# Altium schematic sheet Sheet1.SchDoc: Mạch điều khiển AGV - Đồ án 2
size A4; Date: 18/09/2024; Author: Sáng; CompanyName: IUH; Engineer: Nguyễn Văn Sáng; Organization: Nhóm 12; SheetNumber: 1; SheetTotal: 1; Time: 9:37 AM
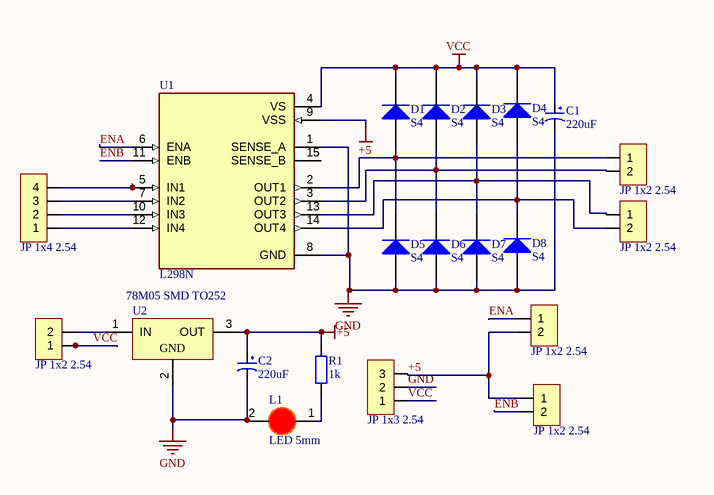
[diagram p0: Sheet1.SchDoc]

## Parts
C1  220uF  [tu hoa 5mm]
C2  220uF  [tu hoa 5mm]
D1  S4  [DIODE SOD-123]
D2  S4  [DIODE SOD-123]
D3  S4  [DIODE SOD-123]
D4  S4  [DIODE SOD-123]
D5  S4  [DIODE SOD-123]
D6  S4  [DIODE SOD-123]
D7  S4  [DIODE SOD-123]
D8  S4  [DIODE SOD-123]
JP1  JP 1x2 2.54  [JP 1x2 CT]
JP2  JP 1x4 2.54  [JP 1x4 DT]
JP3  JP 1x2 2.54  [JP 1x2 CT]
JP4  JP 1x2 2.54  [JP 1x2 CT]
JP5  JP 1x2 2.54  [JP 1x2 CT]
JP6  JP 1x3 2.54  [JP 1x3 CT]
JP7  JP 1x2 2.54  [JP 1x2 CT]
L1  LED 5mm  [LED-5MM-RED]
R1  1k  [tro vach 1/2w]
U1  L298N  [TO127P2020X500X2100-15]
U2  78M05 SMD TO252  [TO252]

## Nets
+5: C2.1 JP4.2 JP6.3 JP7.1 R1.2 U1.9(VSS) U2.3(OUT)
GND: C1.2 C2.2 D5.1(A) D6.1(A) D7.1(A) D8.1(A) JP6.2 L1.2(K) U1.1(SENSE_A) U1.8(GND) U2.2(GND)
VCC: C1.1 D1.2(K) D2.2(K) D3.2(K) D4.2(K) JP5.1 JP6.1 U1.4(VS)
ENA: JP4.1 U1.6(ENA)
ENB: JP7.2 U1.11(ENB)
NetD1_1: D1.1(A) D5.2(K) JP1.1 U1.2(OUT1)
NetD2_1: D2.1(A) D6.2(K) JP1.2 U1.3(OUT2)
NetD3_1: D3.1(A) D7.2(K) JP3.1 U1.13(OUT3)
NetD4_1: D4.1(A) D8.2(K) JP3.2 U1.14(OUT4)
NetJP2_1: JP2.1 U1.12(IN4)
NetJP2_2: JP2.2 U1.10(IN3)
NetJP2_3: JP2.3 U1.7(IN2)
NetJP2_4: JP2.4 U1.5(IN1)
NetJP5_2: JP5.2 U2.1(IN)
NetL1_1: L1.1(A) R1.1

Not connected (* = marked no-connect by the designer): U1 15(SENSE_B)

## Notes on the sheet
- DWG. NO.
- REV.
- SHT.
- REVISION
- DESCRIPTION
- DATE
- APPROVED
- THIS DOCUMENT AND THE DATA DISCLOSED HEREIN OR HEREWITH IS THE PROPERTY OF ALTIUM LIMITED AND MAY BE FREELY DISTRIBUTED IN WHOLE. NO RIGHTS ARE RESERVED OR EXPRESS OR IMPLIED WARANTEE GIVEN.
- ENG:
- DSN:
- APPROVALS
- PROJECT
- DOCUMENT REVISION:
- DESIGN ITEM:
- CHK:
- BOM:
- REFERENCE DOCUMENTS
- PROJECT REVISION:
- TITLE
- FAB DWG:
- PCB DWG:
- ASSY DWG:
- SCALE:
- SIZE
- C
- CAGE CODE
- FILE NAME
- DWG NO.
- SHEET
- OF
- REV

## Library data of the parts
C1 C2 = Tu Hoa 100uF 16V 5x7: Cắm; Don_Vi: Con; So_Chan: 2; Ten_Linh_Kien: Tụ Hóa 100uF 16V 5x7MM; Ma_Hang: MH001347; Chung_Loai: Cắm; Kieu_Chan: *
D1-D8 = Diode S4: Dán; Ten_Linh_Kien: Diode S4 SOD123 ( 1N5819 SOD123); Ma_Hang: MH005519; Don_Vi: Con; Ghi_Chu: *; Chung_Loai: Dán; Kieu_Chan: *
JP1 JP3-JP5 JP7 = JP 1x2 2.54 Cai Thang: Cắm; Ten_Linh_Kien: Jump Đơn Cái 2.54MM 1x20P Thẳng; Don_Vi: Con; Ma_Hang: MH004006; Ghi_Chu: *; Kieu_Chan: *; Chung_Loai: Cắm
JP2 = JP 1x4 2.54 Duc Thang: Cắm; Ten_Linh_Kien: Jump Đơn Đực 2.54MM 1x40P Thẳng 11MM; Don_Vi: Con; Ma_Hang: MH000903; Ghi_Chu: *; Kieu_Chan: *; Chung_Loai: Cắm
JP6 = JP 1x3 2.54 Cai Thang: Cắm; Ten_Linh_Kien: Jump Đơn Cái 2.54MM 1x20P Thẳng; Don_Vi: Con; Ma_Hang: MH004006; Ghi_Chu: *; Kieu_Chan: *; Chung_Loai: Cắm
L1 = LED 5mm Do: Cắm; Don_Vi: Con; Ma_Hang: MH008967; Ten_Linh_Kien: Led 5MM Phủ Đỏ (1000c); Ghi_Chu: *; Kieu_Chan: *; Chung_Loai: Cắm
R1 = Tro Vach 1/2W 5% 270R: Cắm; Don_Vi: Con; So_Chan: 2; Ten_Linh_Kien: Trở 5% 1/2w 270R; Ma_Hang: MH006192; Chung_Loai: Cắm; Kieu_Chan: *
U1 = L298N: Dual Full Bridge Motor Driver 15-Pin(15+Tab) MULTIWATT V Tube; MP: L298N; Availability: Unavailable; Package: None; Value: *; Price: None
U2 = 78M05 SMD TO252: Dán; Don_Vi: Con; Ten_Linh_Kien: 78M05 TO252; Ma_Hang: MH001917; Ghi_Chu: *; Kieu_Chan: *; Chung_Loai: Dán